# Altium schematic sheet LED Dice.SchDoc
size A4; Date: 21 Jul 2025; CompanyName: Abdullah; Engineer: Abdullah; Revision: 2; SheetNumber: 1; SheetTotal: 4
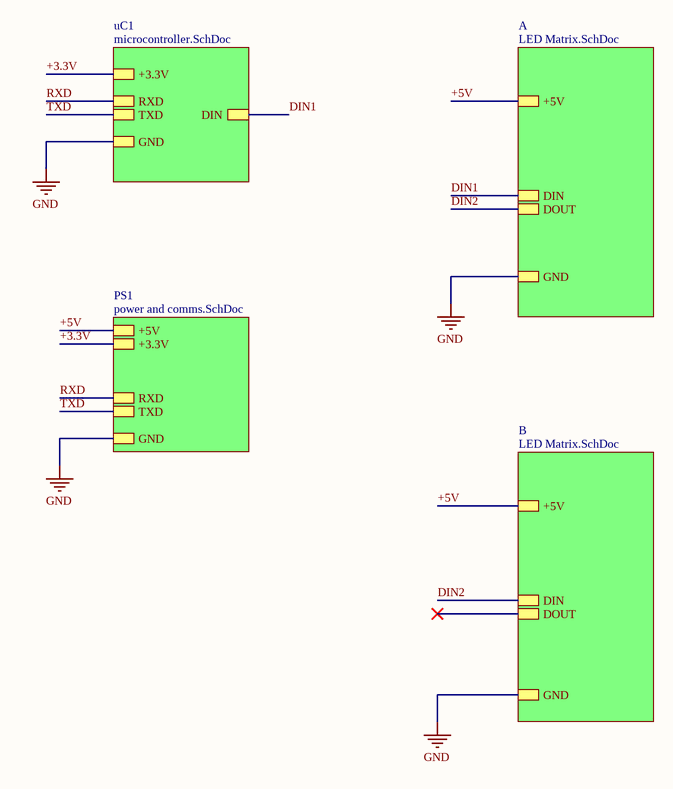
[diagram p0: LED Dice.SchDoc]

## Sub-sheets
A = LED Matrix.SchDoc: GND, +5V, DIN, DOUT
B = LED Matrix.SchDoc: GND, +5V, DIN, DOUT
PS1 = power and comms.SchDoc: +5V, GND, +3.3V, RXD, TXD
uC1 = microcontroller.SchDoc: GND, +3.3V, RXD, TXD, DIN

## Nets
GND: sheet uC1/GND, sheet PS1/GND, sheet A/GND, sheet B/GND
+3.3V: sheet uC1/+3.3V, sheet PS1/+3.3V
+5V: sheet PS1/+5V, sheet A/+5V, sheet B/+5V
DIN1: sheet uC1/DIN, sheet A/DIN
DIN2: sheet A/DOUT, sheet B/DIN
RXD: sheet uC1/RXD, sheet PS1/RXD
TXD: sheet uC1/TXD, sheet PS1/TXD

## Notes on the sheet
- Project Title
- Engineer
- Company
- Revision
- Date
- Doc Name:
- Sheet
- of